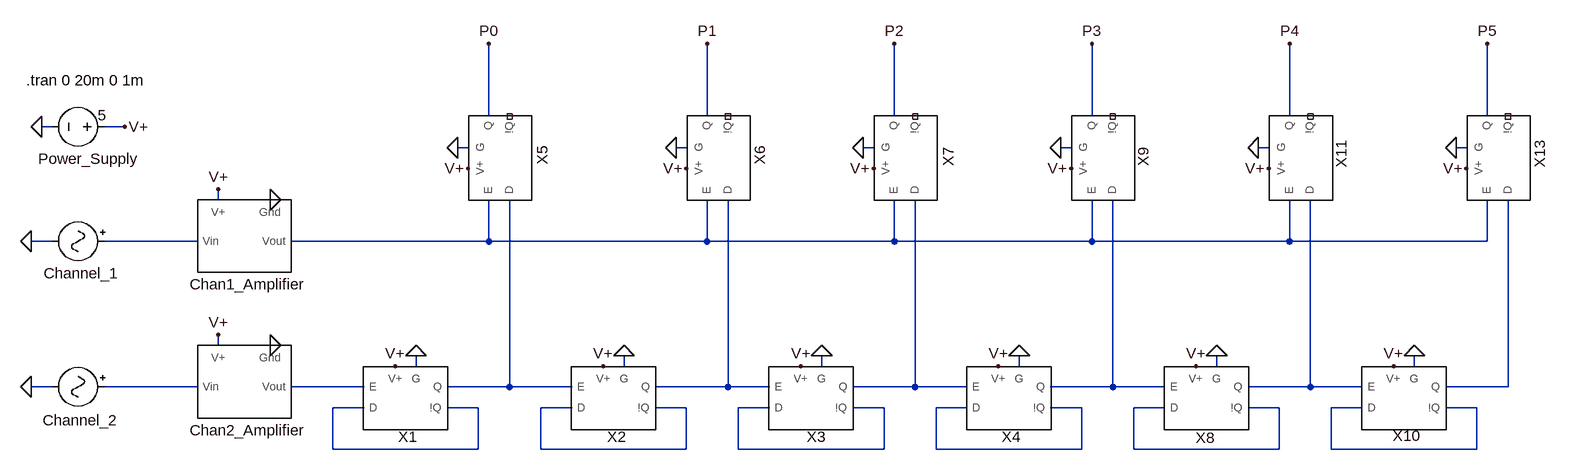
[diagram p0: schematic pulsar.asc]
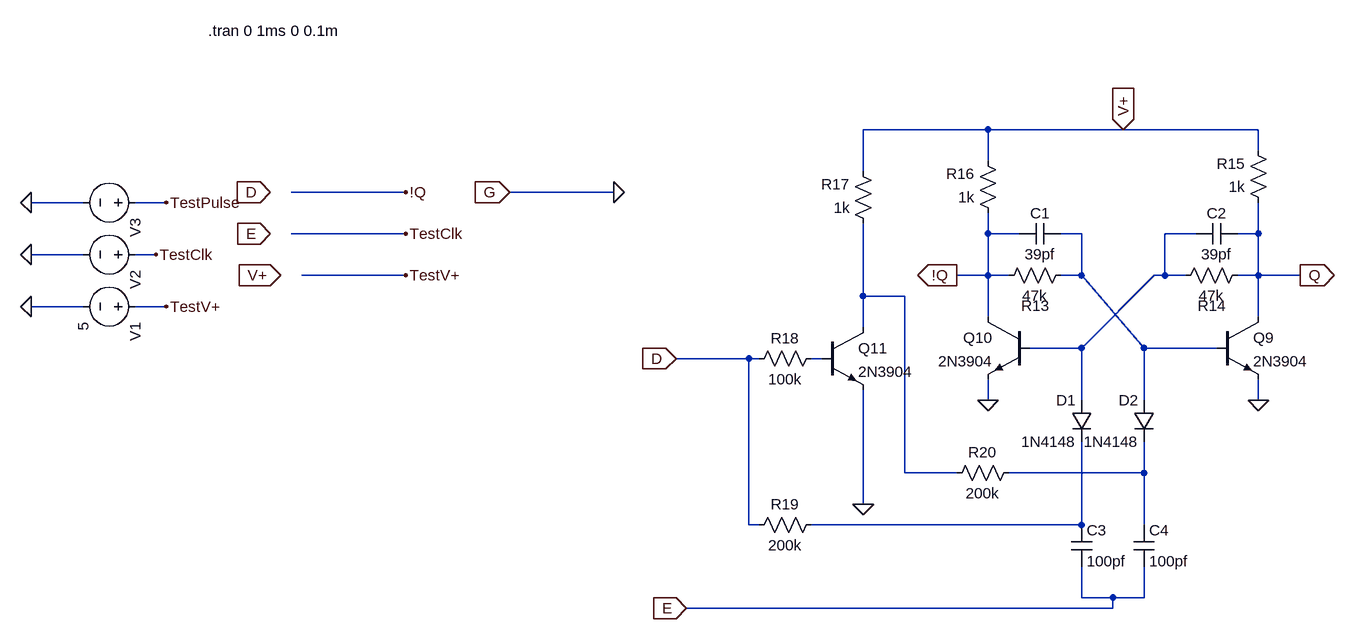
[diagram p1: sub-circuit d-flip-flop.asc]
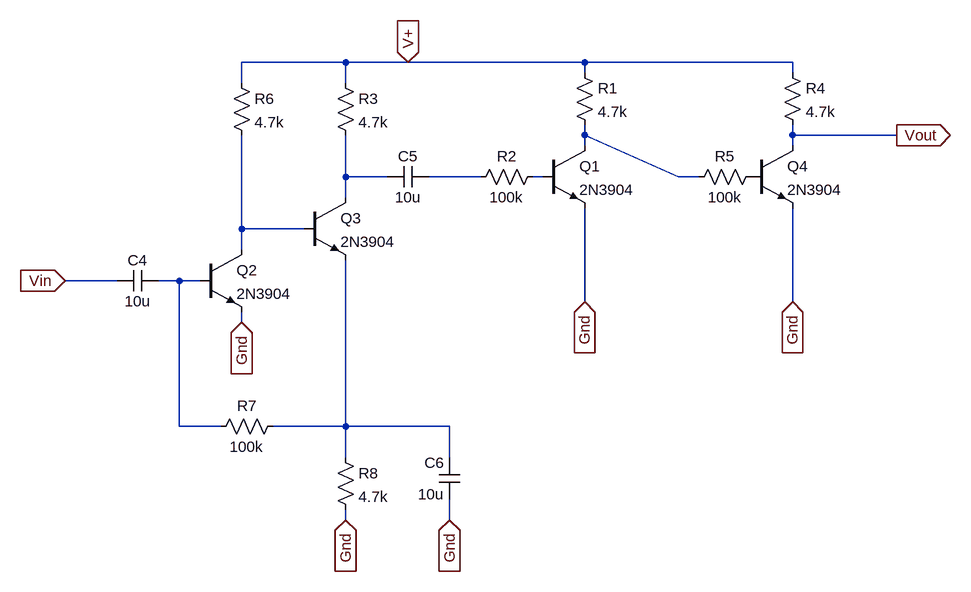
[diagram p2: sub-circuit voltage-amplifier.asc]
pulsar.asc, the LTspice schematic file:
Version 4
SHEET 1 10304 2148
WIRE 2224 -64 2224 -176
WIRE 2560 -64 2560 -176
WIRE 2848 -64 2848 -176
WIRE 3152 -64 3152 -176
WIRE 3456 -64 3456 -176
WIRE 3760 -64 3760 -176
WIRE 1552 -48 1536 -48
WIRE 1664 -48 1632 -48
WIRE 2192 -16 2176 -16
WIRE 2528 -16 2512 -16
WIRE 2816 -16 2800 -16
WIRE 3120 -16 3104 -16
WIRE 3424 -16 3408 -16
WIRE 3728 -16 3712 -16
WIRE 1808 64 1808 48
WIRE 1552 128 1520 128
WIRE 1776 128 1632 128
WIRE 2224 128 2224 64
WIRE 2224 128 1920 128
WIRE 2560 128 2560 64
WIRE 2560 128 2224 128
WIRE 2848 128 2848 64
WIRE 2848 128 2560 128
WIRE 3152 128 3152 64
WIRE 3152 128 2848 128
WIRE 3456 128 3456 64
WIRE 3456 128 3152 128
WIRE 3760 128 3760 64
WIRE 3760 128 3456 128
WIRE 1808 288 1808 272
WIRE 2112 320 2112 304
WIRE 2432 320 2432 304
WIRE 2736 320 2736 304
WIRE 3040 320 3040 304
WIRE 3344 320 3344 304
WIRE 3648 320 3648 304
WIRE 1552 352 1520 352
WIRE 1776 352 1632 352
WIRE 2032 352 1920 352
WIRE 2256 352 2256 64
WIRE 2256 352 2160 352
WIRE 2352 352 2256 352
WIRE 2592 352 2592 64
WIRE 2592 352 2480 352
WIRE 2656 352 2592 352
WIRE 2880 352 2880 64
WIRE 2880 352 2784 352
WIRE 2960 352 2880 352
WIRE 3184 352 3184 64
WIRE 3184 352 3088 352
WIRE 3264 352 3184 352
WIRE 3488 352 3488 64
WIRE 3488 352 3392 352
WIRE 3568 352 3488 352
WIRE 3792 352 3792 64
WIRE 3792 352 3696 352
WIRE 2032 384 1984 384
WIRE 2208 384 2160 384
WIRE 2352 384 2304 384
WIRE 2528 384 2480 384
WIRE 2656 384 2608 384
WIRE 2832 384 2784 384
WIRE 2960 384 2912 384
WIRE 3136 384 3088 384
WIRE 3264 384 3216 384
WIRE 3440 384 3392 384
WIRE 3568 384 3520 384
WIRE 3744 384 3696 384
WIRE 1984 448 1984 384
WIRE 2208 448 2208 384
WIRE 2208 448 1984 448
WIRE 2304 448 2304 384
WIRE 2528 448 2528 384
WIRE 2528 448 2304 448
WIRE 2608 448 2608 384
WIRE 2832 448 2832 384
WIRE 2832 448 2608 448
WIRE 2912 448 2912 384
WIRE 3136 448 3136 384
WIRE 3136 448 2912 448
WIRE 3216 448 3216 384
WIRE 3440 448 3440 384
WIRE 3440 448 3216 448
WIRE 3520 448 3520 384
WIRE 3744 448 3744 384
WIRE 3744 448 3520 448
FLAG 1664 -48 V+
FLAG 1520 352 0
FLAG 2080 320 V+
FLAG 2432 304 0
FLAG 3008 320 V+
FLAG 2224 -176 P0
FLAG 2560 -176 P1
FLAG 2848 -176 P2
FLAG 3152 -176 P3
FLAG 3104 -16 0
FLAG 2800 -16 0
FLAG 2512 -16 0
FLAG 2176 -16 0
FLAG 2528 16 V+
FLAG 2816 16 V+
FLAG 2192 16 V+
FLAG 3120 16 V+
FLAG 3456 -176 P4
FLAG 3408 -16 0
FLAG 3424 16 V+
FLAG 3760 -176 P5
FLAG 3728 16 V+
FLAG 1536 -48 0
FLAG 1520 128 0
FLAG 2112 304 0
FLAG 1808 272 V+
FLAG 1888 288 0
FLAG 1808 48 V+
FLAG 1888 64 0
FLAG 2400 320 V+
FLAG 2704 320 V+
FLAG 2736 304 0
FLAG 3040 304 0
FLAG 3312 320 V+
FLAG 3344 304 0
FLAG 3616 320 V+
FLAG 3648 304 0
FLAG 3712 -16 0
SYMBOL voltage 1648 -48 R90
WINDOW 123 0 0 Left 0
WINDOW 39 0 0 Left 0
WINDOW 0 49 -38 VRight 2
WINDOW 3 -18 12 VRight 2
SYMATTR InstName Power_Supply
SYMATTR Value 5
SYMBOL Misc\\signal 1648 352 R90
WINDOW 3 24 104 Invisible 2
WINDOW 123 0 0 Left 0
WINDOW 39 0 0 Left 0
WINDOW 0 51 -7 VRight 2
SYMATTR Value PULSE(0 1m 3m 1u 1u 50u 100u 2)
SYMATTR InstName Channel_2
SYMBOL d-flip-flop 2096 368 R0
WINDOW 0 3 76 Bottom 2
SYMATTR InstName X1
SYMBOL d-flip-flop 2416 368 R0
WINDOW 0 5 76 Bottom 2
SYMATTR InstName X2
SYMBOL d-flip-flop 2720 368 R0
WINDOW 0 8 76 Bottom 2
SYMATTR InstName X3
SYMBOL d-flip-flop 3024 368 R0
WINDOW 0 4 76 Bottom 2
SYMATTR InstName X4
SYMBOL d-flip-flop 2240 0 R270
WINDOW 0 4 82 Bottom 2
SYMATTR InstName X5
SYMBOL d-flip-flop 2576 0 R270
WINDOW 0 4 81 Bottom 2
SYMATTR InstName X6
SYMBOL d-flip-flop 2864 0 R270
WINDOW 0 2 83 Bottom 2
SYMATTR InstName X7
SYMBOL d-flip-flop 3328 368 R0
WINDOW 0 -2 78 Bottom 2
SYMATTR InstName X8
SYMBOL d-flip-flop 3168 0 R270
WINDOW 0 2 79 Bottom 2
SYMATTR InstName X9
SYMBOL Misc\\signal 1648 128 R90
WINDOW 3 24 104 Invisible 2
WINDOW 123 0 0 Left 0
WINDOW 39 0 0 Left 0
WINDOW 0 49 -8 VRight 2
SYMATTR Value PULSE(0 1m 10m 1u 1u 50u 100u 1)
SYMATTR InstName Channel_1
SYMBOL d-flip-flop 3632 368 R0
WINDOW 0 4 75 Bottom 2
SYMATTR InstName X10
SYMBOL d-flip-flop 3472 0 R270
WINDOW 0 6 79 Bottom 2
SYMATTR InstName X11
SYMBOL d-flip-flop 3776 0 R270
WINDOW 0 6 81 Bottom 2
SYMATTR InstName X13
SYMBOL voltage-amplifier 1840 352 R0
SYMATTR InstName Chan2_Amplifier
SYMBOL voltage-amplifier 1840 128 R0
SYMATTR InstName Chan1_Amplifier
TEXT 1512 -120 Left 2 !.tran 0 20m 0 1m

d-flip-flop.asc, the sub-circuit schematic file:
Version 4
SHEET 1 2308 2588
WIRE 928 -208 736 -208
WIRE 1136 -208 928 -208
WIRE 1344 -208 1136 -208
WIRE 1344 -176 1344 -208
WIRE 928 -160 928 -208
WIRE 736 -144 736 -208
WIRE 32 -112 -144 -112
WIRE 352 -112 192 -112
WIRE -464 -96 -544 -96
WIRE -336 -96 -384 -96
WIRE 32 -48 -144 -48
WIRE 928 -48 928 -80
WIRE 976 -48 928 -48
WIRE 1072 -48 1040 -48
WIRE 1248 -48 1200 -48
WIRE 1344 -48 1344 -96
WIRE 1344 -48 1312 -48
WIRE -464 -16 -544 -16
WIRE -352 -16 -384 -16
WIRE 32 16 -128 16
WIRE 928 16 928 -48
WIRE 928 16 880 16
WIRE 960 16 928 16
WIRE 1072 16 1072 -48
WIRE 1072 16 1040 16
WIRE 1200 16 1200 -48
WIRE 1200 16 1184 16
WIRE 1232 16 1200 16
WIRE 1344 16 1344 -48
WIRE 1344 16 1312 16
WIRE 1408 16 1344 16
WIRE 736 48 736 -64
WIRE 800 48 736 48
WIRE -464 64 -544 64
WIRE -336 64 -384 64
WIRE 928 80 928 16
WIRE 1344 80 1344 16
WIRE 736 96 736 48
WIRE 1072 128 1184 16
WIRE 1072 128 992 128
WIRE 1168 128 1072 16
WIRE 1280 128 1168 128
WIRE 560 144 448 144
WIRE 576 144 560 144
WIRE 672 144 656 144
WIRE 928 208 928 176
WIRE 1072 208 1072 128
WIRE 1168 208 1168 128
WIRE 1344 208 1344 176
WIRE 800 320 800 48
WIRE 880 320 800 320
WIRE 1168 320 1168 272
WIRE 1168 320 960 320
WIRE 736 368 736 192
WIRE 560 400 560 144
WIRE 576 400 560 400
WIRE 1072 400 1072 272
WIRE 1072 400 656 400
WIRE 1168 400 1168 320
WIRE 1072 512 1072 464
WIRE 1120 512 1072 512
WIRE 1168 512 1168 464
WIRE 1168 512 1120 512
WIRE 1120 528 1120 512
WIRE 1120 528 464 528
FLAG -544 64 0
FLAG -544 -16 0
FLAG -336 64 TestV+
FLAG -352 -16 TestClk
FLAG 464 528 E
IOPIN 464 528 In
FLAG -176 -48 E
IOPIN -176 -48 In
FLAG -160 16 V+
IOPIN -160 16 In
FLAG 32 16 TestV+
FLAG 32 -48 TestClk
FLAG 192 -112 G
IOPIN 192 -112 In
FLAG 352 -112 0
FLAG -544 -96 0
FLAG -336 -96 TestPulse
FLAG -176 -112 D
IOPIN -176 -112 In
FLAG 448 144 D
IOPIN 448 144 In
FLAG 32 -112 !Q
FLAG 1136 -208 V+
IOPIN 1136 -208 In
FLAG 928 208 0
FLAG 1344 208 0
FLAG 736 368 0
FLAG 1408 16 Q
IOPIN 1408 16 Out
FLAG 880 16 !Q
IOPIN 880 16 Out
SYMBOL voltage -368 64 R90
WINDOW 123 0 0 Left 0
WINDOW 39 0 0 Left 0
SYMATTR InstName V1
SYMATTR Value 5
SYMBOL voltage -368 -16 R90
WINDOW 3 24 96 Invisible 2
WINDOW 123 0 0 Left 0
WINDOW 39 0 0 Left 0
SYMATTR Value PULSE(0 5 0.25ms 100n 100n 25u 50u 10)
SYMATTR InstName V2
SYMBOL voltage -368 -96 R90
WINDOW 3 24 96 Invisible 2
WINDOW 123 0 0 Left 0
WINDOW 39 0 0 Left 0
SYMATTR Value PULSE(0 5 0.25ms 1n 1n 25u 50u 1)
SYMATTR InstName V3
SYMBOL npn 1280 80 R0
SYMATTR InstName Q9
SYMATTR Value 2N3904
SYMBOL npn 992 80 M0
SYMATTR InstName Q10
SYMATTR Value 2N3904
SYMBOL res 1056 0 R90
WINDOW 0 78 55 VBottom 2
WINDOW 3 32 56 VTop 2
SYMATTR InstName R13
SYMATTR Value 47k
SYMBOL res 1328 0 R90
WINDOW 0 78 55 VBottom 2
WINDOW 3 32 56 VTop 2
SYMATTR InstName R14
SYMATTR Value 47k
SYMBOL diode 1088 208 M0
SYMATTR InstName D1
SYMATTR Value 1N4148
SYMBOL diode 1184 208 M0
SYMATTR InstName D2
SYMATTR Value 1N4148
SYMBOL res 1360 -80 R180
WINDOW 0 36 76 Left 2
WINDOW 3 36 40 Left 2
SYMATTR InstName R15
SYMATTR Value 1k
SYMBOL res 944 -64 R180
WINDOW 0 36 76 Left 2
WINDOW 3 36 40 Left 2
SYMATTR InstName R16
SYMATTR Value 1k
SYMBOL cap 976 -32 R270
WINDOW 0 32 32 VTop 2
WINDOW 3 0 32 VBottom 2
SYMATTR InstName C1
SYMATTR Value 39pf
SYMBOL cap 1248 -32 R270
WINDOW 0 32 32 VTop 2
WINDOW 3 0 32 VBottom 2
SYMATTR InstName C2
SYMATTR Value 39pf
SYMBOL cap 1056 400 R0
SYMATTR InstName C3
SYMATTR Value 100pf
SYMBOL cap 1152 400 R0
SYMATTR InstName C4
SYMATTR Value 100pf
SYMBOL npn 672 96 R0
SYMATTR InstName Q11
SYMATTR Value 2N3904
SYMBOL res 752 -48 R180
WINDOW 0 36 76 Left 2
WINDOW 3 36 40 Left 2
SYMATTR InstName R17
SYMATTR Value 1k
SYMBOL res 560 160 R270
WINDOW 0 32 56 VTop 2
WINDOW 3 0 56 VBottom 2
SYMATTR InstName R18
SYMATTR Value 100k
SYMBOL res 560 416 R270
WINDOW 0 32 56 VTop 2
WINDOW 3 0 56 VBottom 2
SYMATTR InstName R19
SYMATTR Value 200k
SYMBOL res 864 336 R270
WINDOW 0 32 56 VTop 2
WINDOW 3 0 56 VBottom 2
SYMATTR InstName R20
SYMATTR Value 200k
TEXT -272 -360 Left 2 !.tran 0 1ms 0 0.1m

voltage-amplifier.asc, the sub-circuit schematic file:
Version 4
SHEET 1 10304 2148
WIRE 1120 -176 960 -176
WIRE 1216 -176 1120 -176
WIRE 1488 -176 1216 -176
WIRE 1808 -176 1488 -176
WIRE 1488 -160 1488 -176
WIRE 1808 -160 1808 -176
WIRE 960 -144 960 -176
WIRE 1120 -144 1120 -176
WIRE 1488 -64 1488 -80
WIRE 1808 -64 1808 -80
WIRE 1968 -64 1808 -64
WIRE 1488 -48 1488 -64
WIRE 1808 -48 1808 -64
WIRE 1120 0 1120 -64
WIRE 1184 0 1120 0
WIRE 1328 0 1248 0
WIRE 1424 0 1408 0
WIRE 1632 0 1488 -64
WIRE 1664 0 1632 0
WIRE 1120 32 1120 0
WIRE 960 80 960 -64
WIRE 1056 80 960 80
WIRE 960 112 960 80
WIRE 768 160 688 160
WIRE 864 160 832 160
WIRE 896 160 864 160
WIRE 1488 192 1488 48
WIRE 1808 192 1808 48
WIRE 960 224 960 208
WIRE 864 384 864 160
WIRE 928 384 864 384
WIRE 1120 384 1120 128
WIRE 1120 384 1008 384
WIRE 1280 384 1120 384
WIRE 1120 432 1120 384
WIRE 1280 432 1280 384
WIRE 1120 528 1120 512
WIRE 1280 528 1280 496
FLAG 1216 -176 V+
IOPIN 1216 -176 In
FLAG 688 160 Vin
IOPIN 688 160 In
FLAG 1968 -64 Vout
IOPIN 1968 -64 Out
FLAG 1120 528 Gnd
IOPIN 1120 528 In
FLAG 1280 528 Gnd
IOPIN 1280 528 In
FLAG 960 224 Gnd
IOPIN 960 224 In
FLAG 1488 192 Gnd
IOPIN 1488 192 In
FLAG 1808 192 Gnd
IOPIN 1808 192 In
SYMBOL npn 896 112 R0
SYMATTR InstName Q2
SYMATTR Value 2N3904
SYMBOL npn 1056 32 R0
SYMATTR InstName Q3
SYMATTR Value 2N3904
SYMBOL cap 832 144 R90
WINDOW 0 0 32 VBottom 2
WINDOW 3 32 32 VTop 2
SYMATTR InstName C4
SYMATTR Value 10u
SYMBOL cap 1248 -16 R90
WINDOW 0 0 32 VBottom 2
WINDOW 3 32 32 VTop 2
SYMATTR InstName C5
SYMATTR Value 10u
SYMBOL res 1104 -160 R0
SYMATTR InstName R3
SYMATTR Value 4.7k
SYMBOL res 944 -160 R0
SYMATTR InstName R6
SYMATTR Value 4.7k
SYMBOL res 1024 368 R90
WINDOW 0 0 56 VBottom 2
WINDOW 3 32 56 VTop 2
SYMATTR InstName R7
SYMATTR Value 100k
SYMBOL res 1104 416 R0
SYMATTR InstName R8
SYMATTR Value 4.7k
SYMBOL cap 1296 496 R180
WINDOW 0 24 56 Left 2
WINDOW 3 24 8 Left 2
SYMATTR InstName C6
SYMATTR Value 10u
SYMBOL npn 1424 -48 R0
SYMATTR InstName Q1
SYMATTR Value 2N3904
SYMBOL res 1472 -176 R0
SYMATTR InstName R1
SYMATTR Value 4.7k
SYMBOL res 1424 -16 R90
WINDOW 0 0 56 VBottom 2
WINDOW 3 32 56 VTop 2
SYMATTR InstName R2
SYMATTR Value 100k
SYMBOL npn 1744 -48 R0
SYMATTR InstName Q4
SYMATTR Value 2N3904
SYMBOL res 1792 -176 R0
SYMATTR InstName R4
SYMATTR Value 4.7k
SYMBOL res 1760 -16 R90
WINDOW 0 0 56 VBottom 2
WINDOW 3 32 56 VTop 2
SYMATTR InstName R5
SYMATTR Value 100k

The netlist it stands for:
* pulsar.asc
V§Power_Supply V+ 0 5
V§Channel_2 N003 0 PULSE(0 1m 3m 1u 1u 50u 100u 2)
XX1 N004 N011 0 V+ N011 N005 d-flip-flop
XX2 N005 N012 0 V+ N012 N006 d-flip-flop
XX3 N006 N013 0 V+ N013 N007 d-flip-flop
XX4 N007 N014 0 V+ N014 N008 d-flip-flop
XX5 N002 N005 0 V+ NC_01 P0 d-flip-flop
XX6 N002 N006 0 V+ NC_02 P1 d-flip-flop
XX7 N002 N007 0 V+ NC_03 P2 d-flip-flop
XX8 N008 N015 0 V+ N015 N009 d-flip-flop
XX9 N002 N008 0 V+ NC_04 P3 d-flip-flop
V§Channel_1 N001 0 PULSE(0 1m 10m 1u 1u 50u 100u 1)
XX10 N009 N016 0 V+ N016 N010 d-flip-flop
XX11 N002 N009 0 V+ NC_05 P4 d-flip-flop
XX13 N002 N010 0 V+ NC_06 P5 d-flip-flop
XChan2_Amplifier 0 V+ N003 N004 voltage-amplifier
XChan1_Amplifier 0 V+ N001 N002 voltage-amplifier

* block symbol definitions
.subckt d-flip-flop E D G V+ !Q Q
V1 TestV+ 0 5
V2 TestClk 0 PULSE(0 5 0.25ms 100n 100n 25u 50u 10)
V3 TestPulse 0 PULSE(0 5 0.25ms 1n 1n 25u 50u 1)
Q9 Q N001 0 0 2N3904
Q10 !Q N002 0 0 2N3904
R13 N001 !Q 47k
R14 Q N002 47k
D1 N002 N006 1N4148
D2 N001 N005 1N4148
R15 Q V+ 1k
R16 !Q V+ 1k
C1 !Q N001 39pf
C2 N002 Q 39pf
C3 N006 E 100pf
C4 N005 E 100pf
Q11 N003 N004 0 0 2N3904
R17 N003 V+ 1k
R18 D N004 100k
R19 D N006 200k
R20 N003 N005 200k
.tran 0 1ms 0 0.1m
.ends d-flip-flop

.subckt voltage-amplifier Gnd V+ Vin Vout
Q2 N005 N006 Gnd 0 2N3904
Q3 N002 N005 N007 0 2N3904
C4 N006 Vin 10u
C5 N003 N002 10u
R3 V+ N002 4.7k
R6 V+ N005 4.7k
R7 N007 N006 100k
R8 N007 Gnd 4.7k
C6 Gnd N007 10u
Q1 N001 N004 Gnd 0 2N3904
R1 V+ N001 4.7k
R2 N004 N003 100k
Q4 Vout P001 Gnd 0 2N3904
R4 V+ Vout 4.7k
R5 P001 N001 100k
.ends voltage-amplifier

.model D D
.lib standard.dio
.model NPN NPN
.model PNP PNP
.lib standard.bjt
.tran 0 20m 0 1m
.backanno
.end